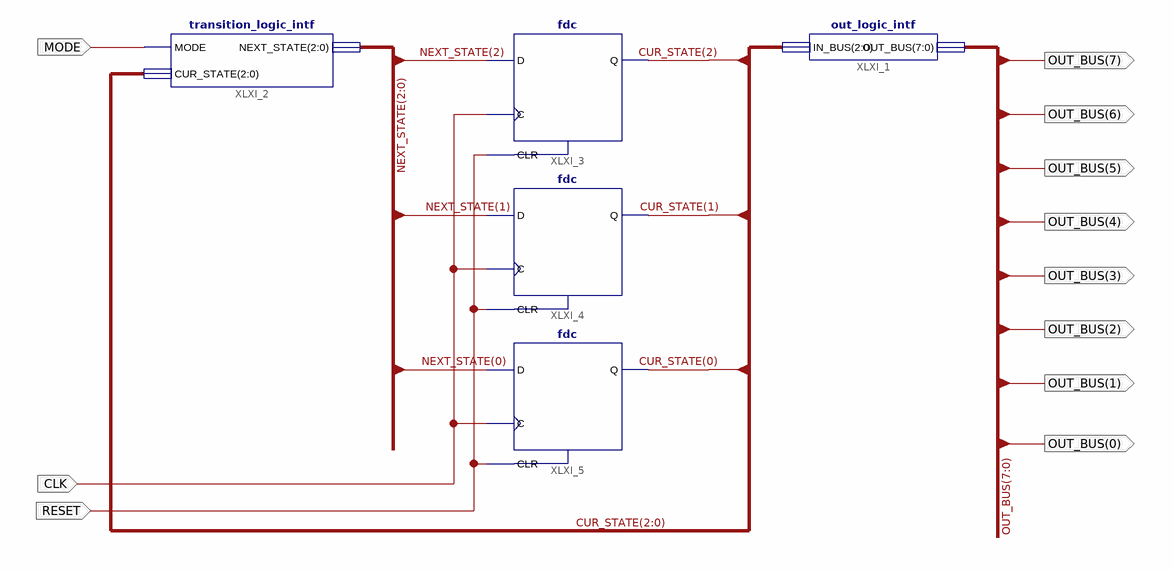
[diagram p0: schematic sheet 1]
// Xilinx ISE schematic LightController.sch (spartan3a) as structural Verilog: 5 symbols, 11 ports
module LightController (
  input  RESET,
  input  CLK,
  input  MODE,
  output [7:0] OUT_BUS
);

  wire [2:0] CUR_STATE, NEXT_STATE;

  out_logic_intf XLXI_1 (.IN_BUS(CUR_STATE), .OUT_BUS(OUT_BUS));
  transition_logic_intf XLXI_2 (.MODE(MODE), .CUR_STATE(CUR_STATE), .NEXT_STATE(NEXT_STATE));
  fdc XLXI_3 (.C(CLK), .CLR(RESET), .D(NEXT_STATE[2]), .Q(CUR_STATE[2]));
  fdc XLXI_4 (.C(CLK), .CLR(RESET), .D(NEXT_STATE[1]), .Q(CUR_STATE[1]));
  fdc XLXI_5 (.C(CLK), .CLR(RESET), .D(NEXT_STATE[0]), .Q(CUR_STATE[0]));
endmodule
